# Altium schematic sheet PUSH.SchDoc
size A4
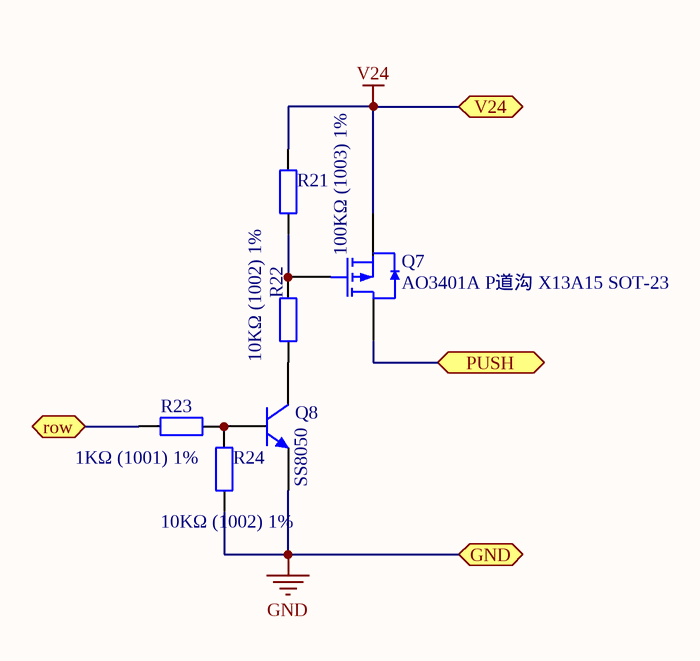
[diagram p0: PUSH.SchDoc]

## Parts
Q7  AO3401A P道沟 X13A15 SOT-23  [SOT-23-3L]
Q8  SS8050  [SOT-23(SOT-23-3)]
R21  100KΩ (1003) 1%  [0805_R]
R22  10KΩ (1002) 1%  [0805_R]
R23  1KΩ (1001) 1%  [0805_R]
R24  10KΩ (1002) 1%  [0805_R]

## Ports
GND, PUSH, row, V24

## Nets
GND: Q8.2(E) R24.2 ; port GND
V24: Q7.2(S) R21.1 ; port V24
PUSH: Q7.3(D) ; port PUSH
row: R23.2 ; port row
NetQ7_1: Q7.1(G) R21.2 R22.2
NetQ8_1: Q8.1(B) R23.1 R24.1
NetQ8_3: Q8.3(C) R22.1

## Library data of the parts
Q7 = AO3401A P道沟 X13A15 SOT-23: MOS(场效应管); ComponentLink1Description: 供应商链接; ComponentLink1URL: http://www.szlcsc.com/product/details_15801.html; Package: SOT-23; Supplier: LC; SuppliersPartNumber: C15127
Q8 = SOT-23 SS8050 Y1: 三极管; ComponentLink1Description: 供应商链接; ComponentLink1URL: http://www.szlcsc.com/product/details_2507.html; Package: SOT-23; Supplier: LC; SuppliersPartNumber: C2150
R21 = 0805 100KΩ (1003) 1%: 贴片电阻; ComponentLink1Description: 供应商链接; ComponentLink1URL: http://www.szlcsc.com/product/details_18095.html; Package: 0805; Supplier: LC; SuppliersPartNumber: C17407
R22 R24 = 0805 10KΩ (1002) 1%: 贴片电阻; ComponentLink1Description: 供应商链接; ComponentLink1URL: http://www.szlcsc.com/product/details_18102.html; Package: 0805; Supplier: LC; SuppliersPartNumber: C17414
R23 = 0805 1KΩ (1001) 1%: 贴片电阻; ComponentLink1Description: 供应商链接; ComponentLink1URL: http://www.szlcsc.com/product/details_18201.html; Package: 0805; Supplier: LC; SuppliersPartNumber: C17513